# EAGLE design Faders (EAGLE 7.4.0)
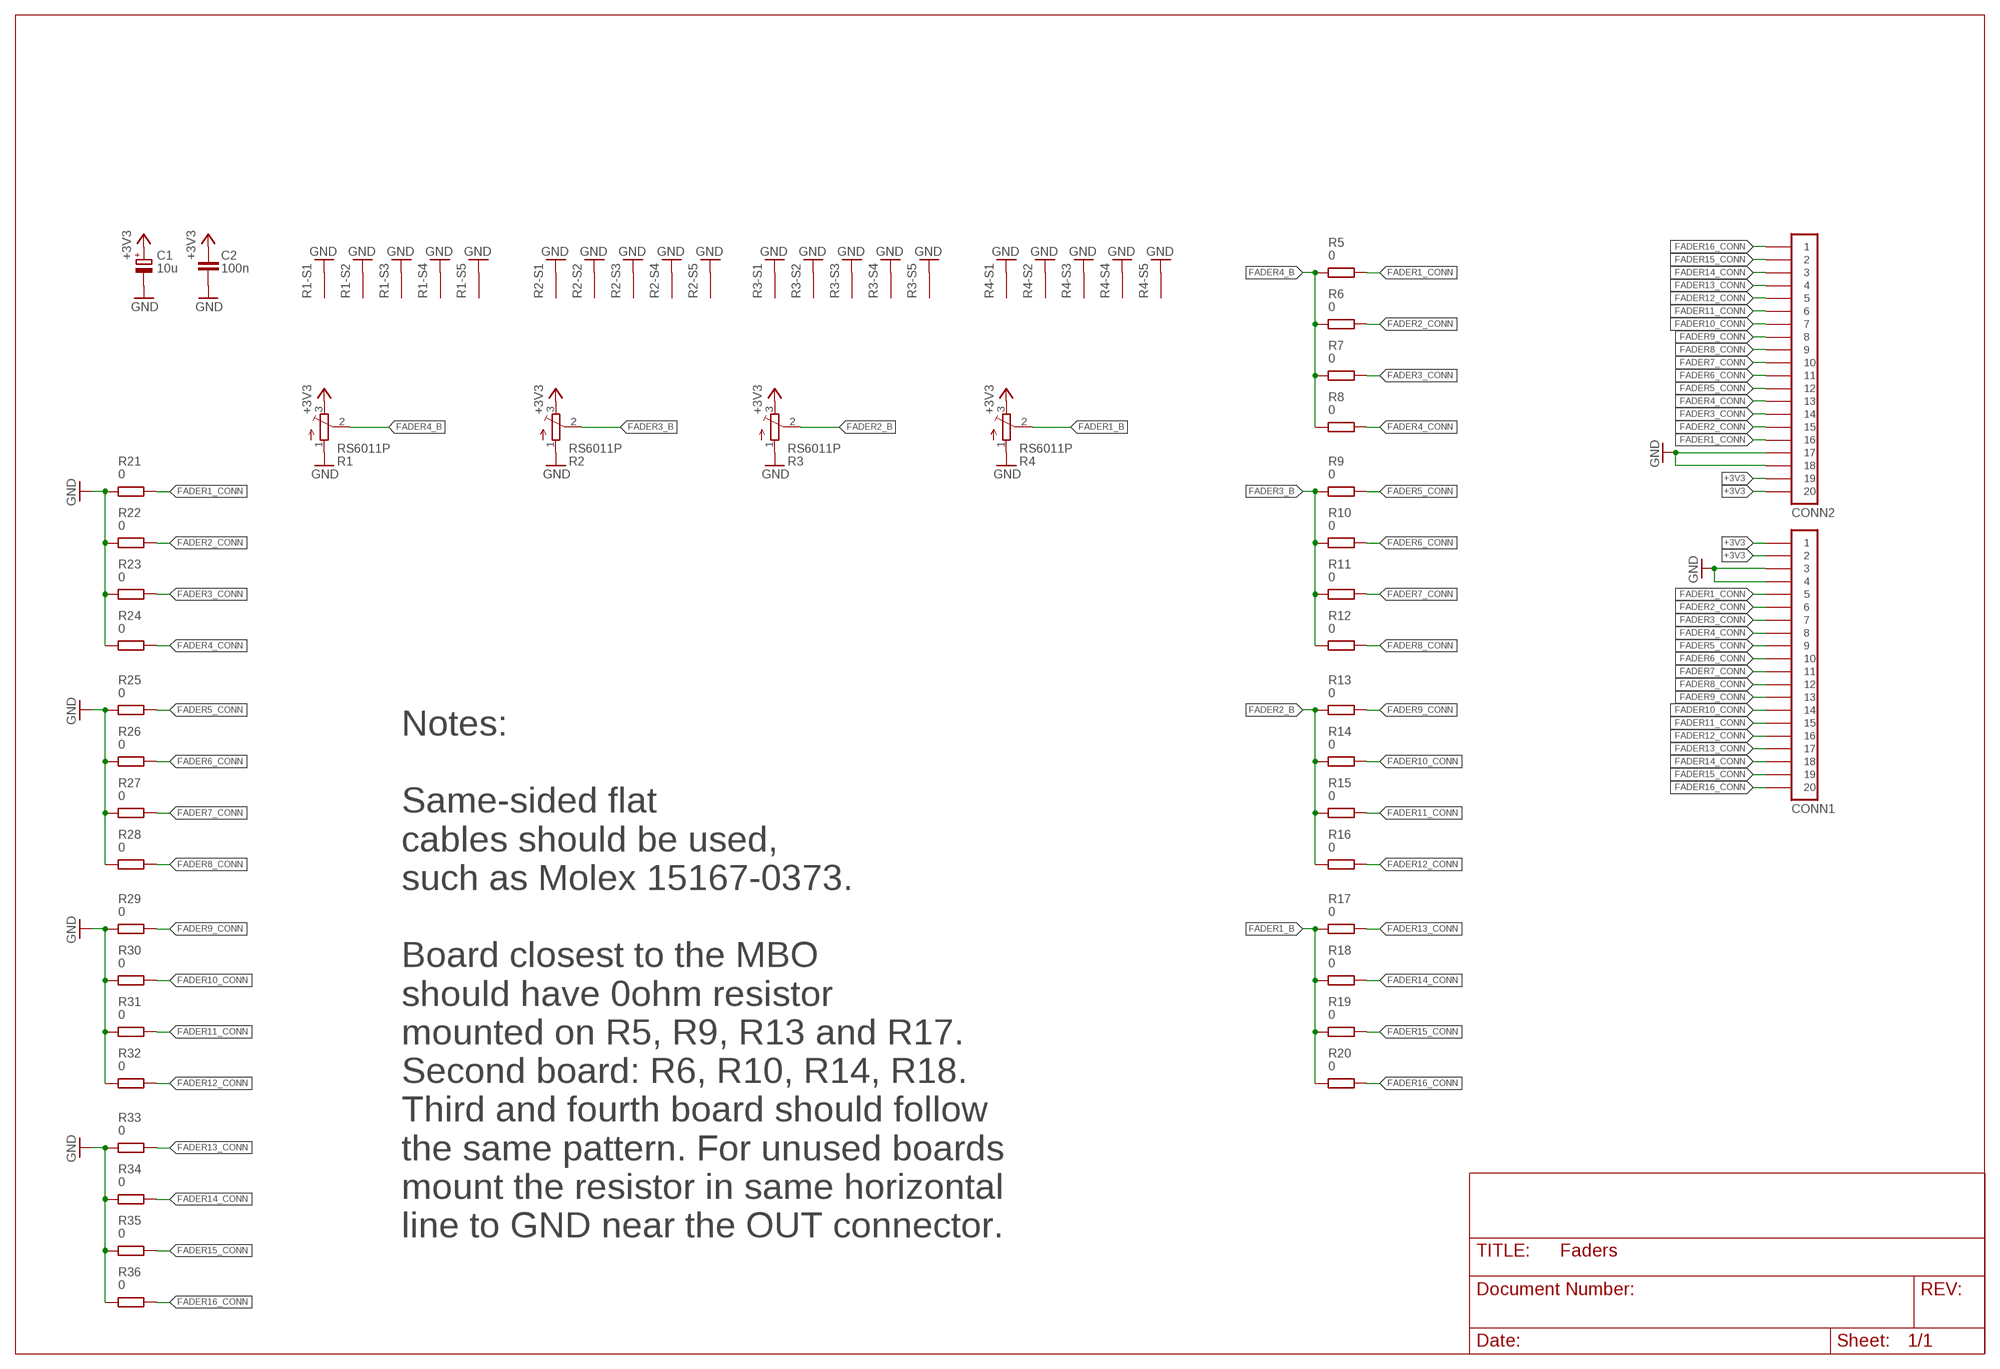
[diagram p0: schematic, sheet 1]

## Parts
C1  10u  ELECTROLYTIC_CAPACITOR-C-TH-E-0401  [C-TH-E-0401]
C2  100n  CAPACITOR-0805  [C0805]
CONN1  PINHD-1X20-SMD  [MOLEX-52271-2079]
CONN2  PINHD-1X20-SMD  [MOLEX-52271-2079]
R1  RS6011P  [RS6011*P]
R2  RS6011P  [RS6011*P]
R3  RS6011P  [RS6011*P]
R4  RS6011P  [RS6011*P]
R5  0  RESISTOR-0805  [R0805]
R6  0  RESISTOR-0805  [R0805]
R7  0  RESISTOR-0805  [R0805]
R8  0  RESISTOR-0805  [R0805]
R9  0  RESISTOR-0805  [R0805]
R10  0  RESISTOR-0805  [R0805]
R11  0  RESISTOR-0805  [R0805]
R12  0  RESISTOR-0805  [R0805]
R13  0  RESISTOR-0805  [R0805]
R14  0  RESISTOR-0805  [R0805]
R15  0  RESISTOR-0805  [R0805]
R16  0  RESISTOR-0805  [R0805]
R17  0  RESISTOR-0805  [R0805]
R18  0  RESISTOR-0805  [R0805]
R19  0  RESISTOR-0805  [R0805]
R20  0  RESISTOR-0805  [R0805]
R21  0  RESISTOR-0805  [R0805]
R22  0  RESISTOR-0805  [R0805]
R23  0  RESISTOR-0805  [R0805]
R24  0  RESISTOR-0805  [R0805]
R25  0  RESISTOR-0805  [R0805]
R26  0  RESISTOR-0805  [R0805]
R27  0  RESISTOR-0805  [R0805]
R28  0  RESISTOR-0805  [R0805]
R29  0  RESISTOR-0805  [R0805]
R30  0  RESISTOR-0805  [R0805]
R31  0  RESISTOR-0805  [R0805]
R32  0  RESISTOR-0805  [R0805]
R33  0  RESISTOR-0805  [R0805]
R34  0  RESISTOR-0805  [R0805]
R35  0  RESISTOR-0805  [R0805]
R36  0  RESISTOR-0805  [R0805]

## Nets
+3V3: C1.+ C2.1 CONN1.1 CONN1.2 CONN2.19 CONN2.20 R1.3 R2.3 R3.3 R4.3
FADER1_B: R4.2 R17.1 R18.1 R19.1 R20.1
FADER1_CONN: CONN1.5 CONN2.16 R5.2 R21.2
FADER2_B: R3.2 R13.1 R14.1 R15.1 R16.1
FADER2_CONN: CONN1.6 CONN2.15 R6.2 R22.2
FADER3_B: R2.2 R9.1 R10.1 R11.1 R12.1
FADER3_CONN: CONN1.7 CONN2.14 R7.2 R23.2
FADER4_B: R1.2 R5.1 R6.1 R7.1 R8.1
FADER4_CONN: CONN1.8 CONN2.13 R8.2 R24.2
FADER5_CONN: CONN1.9 CONN2.12 R9.2 R25.2
FADER6_CONN: CONN1.10 CONN2.11 R10.2 R26.2
FADER7_CONN: CONN1.11 CONN2.10 R11.2 R27.2
FADER8_CONN: CONN1.12 CONN2.9 R12.2 R28.2
FADER9_CONN: CONN1.13 CONN2.8 R13.2 R29.2
FADER10_CONN: CONN1.14 CONN2.7 R14.2 R30.2
FADER11_CONN: CONN1.15 CONN2.6 R15.2 R31.2
FADER12_CONN: CONN1.16 CONN2.5 R16.2 R32.2
FADER13_CONN: CONN1.17 CONN2.4 R17.2 R33.2
FADER14_CONN: CONN1.18 CONN2.3 R18.2 R34.2
FADER15_CONN: CONN1.19 CONN2.2 R19.2 R35.2
FADER16_CONN: CONN1.20 CONN2.1 R20.2 R36.2
GND: C1.- C2.2 CONN1.3 CONN1.4 CONN2.17 CONN2.18 R1.1 R1.S1(S) R1.S2(S) R1.S3(S) R1.S4(S) R1.S5(S) R2.1 R2.S1(S) R2.S2(S) R2.S3(S) R2.S4(S) R2.S5(S) R3.1 R3.S1(S) R3.S2(S) R3.S3(S) R3.S4(S) R3.S5(S) R4.1 R4.S1(S) R4.S2(S) R4.S3(S) R4.S4(S) R4.S5(S) R21.1 R22.1 R23.1 R24.1 R25.1 R26.1 R27.1 R28.1 R29.1 R30.1 R31.1 R32.1 R33.1 R34.1 R35.1 R36.1

## Notes on the sheet
- Notes:
  
  Same-sided flat
  cables should be used,
  such as Molex 15167-0373.
  
  Board closest to the MBO
  should have 0ohm resistor
  mounted on R5, R9, R13 and R17.
  Second board: R6, R10, R14, R18.
  Third and fourth board should follow
  the same pattern. For unused boards
  mount the resistor in same horizontal
  line to GND near the OUT connector.

## Library data of the parts
C1 = igor_lbr:ELECTROLYTIC_CAPACITOR: Electrolytic capacitor
C2 = igor_lbr:CAPACITOR: Capacitor
CONN1 CONN2 = igor_lbr:PINHD-1X20: Pin header, 20 pins; MANUFACTURER: Molex; MPN: 52271-2079
R1-R4 = igor_lbr:RS6011*P: Potentiometer
R5-R36 = igor_lbr:RESISTOR: Resistor

## Board
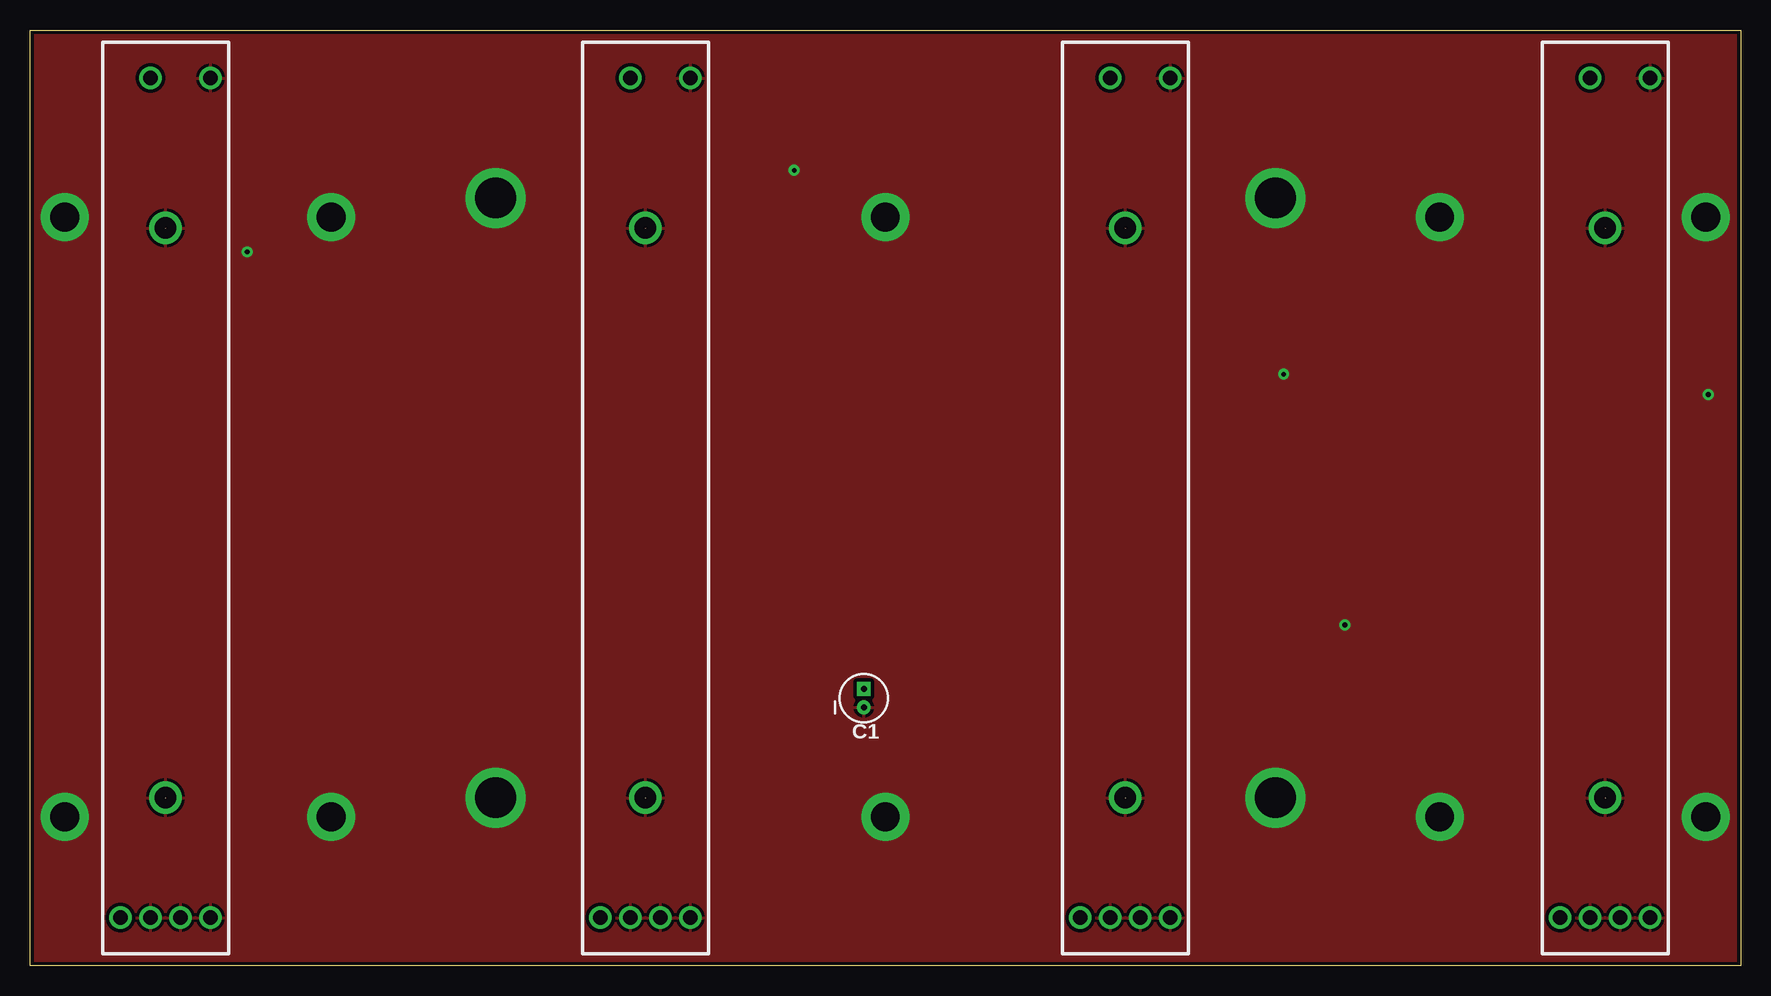
[diagram p1: board, top side]
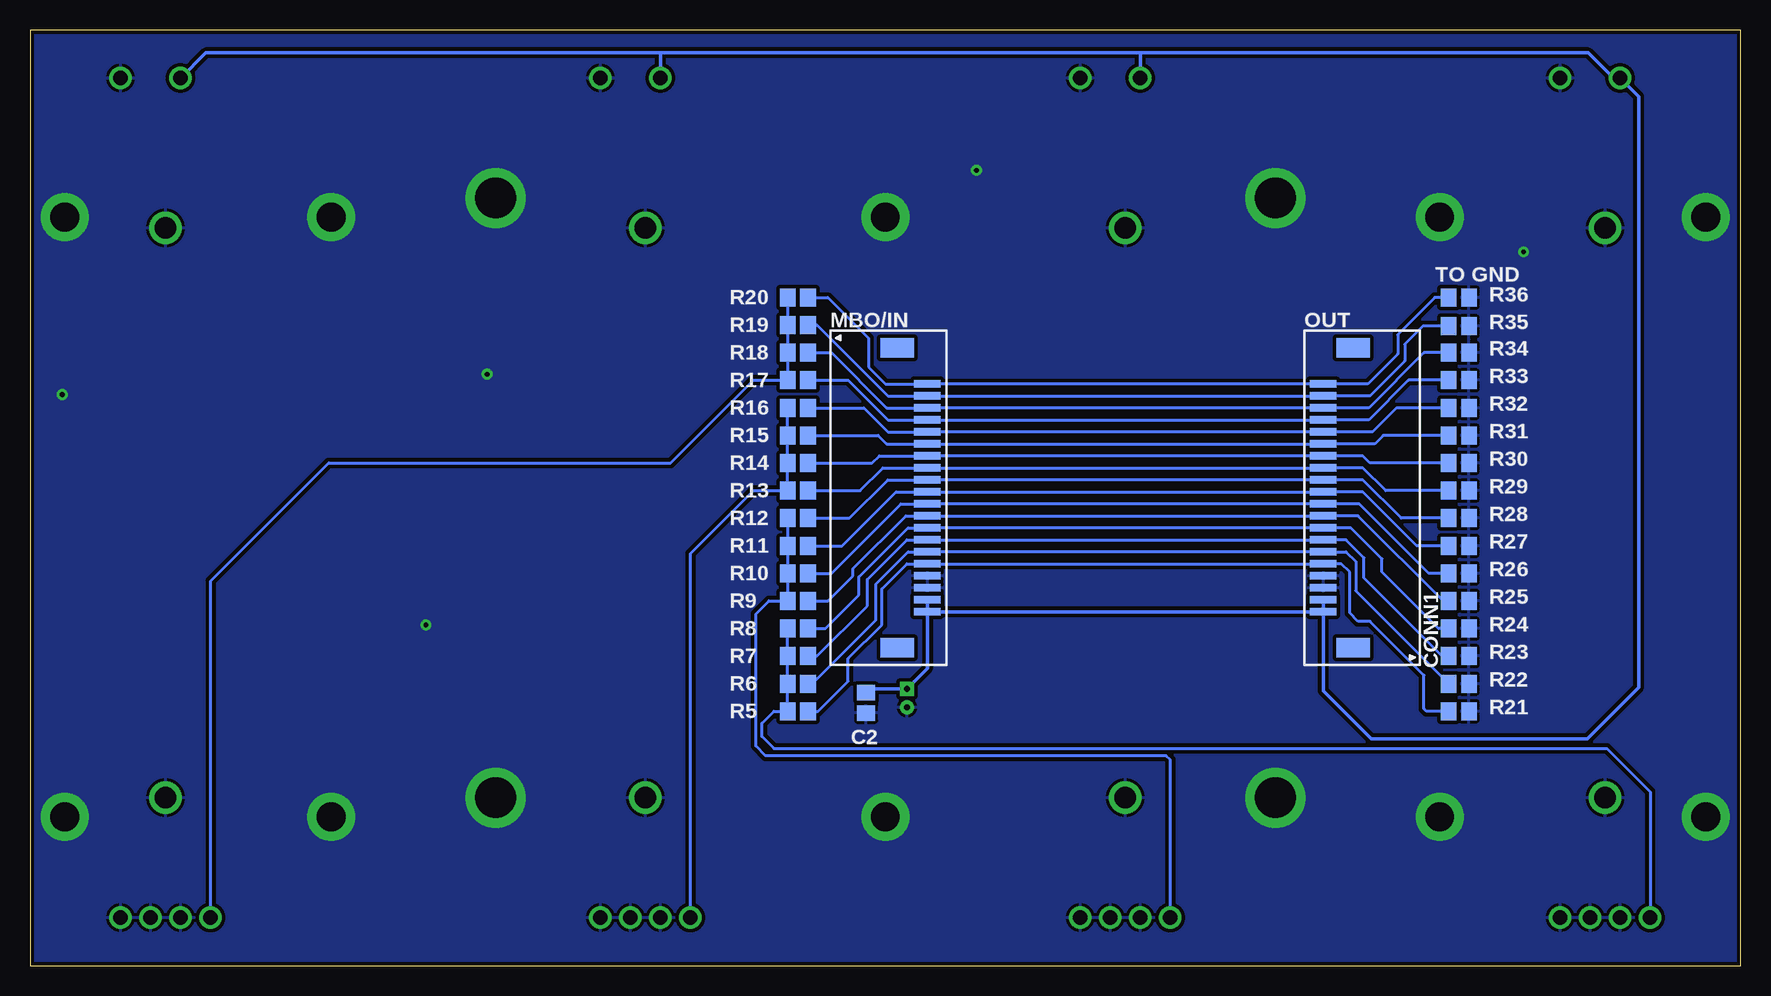
[diagram p2: board, bottom side, seen from below]

Size 142.6 x 78 mm. Coordinates in mm from the lower left corner, seen from the top.
Outline: 0,78 142.6,78 142.6,0 0,0 0,78
Copper layers (1*16): Top 0.035mm / dielectric 1.5mm / Bottom 0.035mm
Design rules "smiery *": minimum track width 10mil, minimum drill 12mil, track to track 7mil, track to pad 5mil, pad to pad 4mil, via to via 6mil, smd to smd 0mil, copper to edge 12mil, drill to drill 10mil, minimum pad ring 13mil, minimum via ring 10mil, stop-mask expansion 2mil, vias tented up to drill 25mil, thermal gap 10mil

### Footprints (pad centres in the part's own frame; a part is rotated, then mirrored left to right if it is on the bottom)
C-TH-E-0401 = drill 0.5 square: + 0.77,0 | drill 0.5: - -0.77,0
C0805 = smd 1.3 x 1.5: 1 -0.85,0; 2 0.85,0
MOLEX-52271-2079 = smd 0.6 x 2.2: 1 -9.5,3.5; 2 -8.5,3.5; 3 -7.5,3.5; 4 -6.5,3.5; 5 -5.5,3.5; 6 -4.5,3.5; 7 -3.5,3.5; 8 -2.5,3.5; 9 -1.5,3.5; 10 -0.5,3.5; 11 0.5,3.5; 12 1.5,3.5; 13 2.5,3.5; 14 3.5,3.5; 15 4.5,3.5; 16 5.5,3.5; 17 6.5,3.5; 18 7.5,3.5; 19 8.5,3.5; 20 9.5,3.5 | smd 1.65 x 2.8: S1 -12.5,1; S2 12.5,1
RS6011*P = drill 1.2: 1 -35,1.25; 2 -35,3.75; 3 35,1.25; S1 -35,-1.25; S2 -35,-3.75; S5 35,-3.75 | drill 1.8: S3 -25,0; S4 22.5,0
R0805 = smd 1.3 x 1.5: 1 -0.85,0; 2 0.85,0

### Placement (x,y rotation side)
C1  69.5,22.3 90 top
C2  72.9,21.9 270 bottom
CONN1  31.3,39 90 bottom
CONN2  71.3,39 270 bottom
R1  11.3,39 90 top
R2  51.3,39 90 top
R3  91.3,39 90 top
R4  131.3,39 90 top
R5  78.6,21.2 0 bottom
R6  78.6,23.5 0 bottom
R7  78.6,25.8 0 bottom
R8  78.6,28.1 0 bottom
R9  78.6,30.4 0 bottom
R10  78.6,32.7 0 bottom
R11  78.6,35 0 bottom
R12  78.6,37.3 0 bottom
R13  78.6,39.6 0 bottom
R14  78.6,41.9 0 bottom
R15  78.6,44.2 0 bottom
R16  78.6,46.5 0 bottom
R17  78.6,48.8 0 bottom
R18  78.6,51.1 0 bottom
R19  78.6,53.4 0 bottom
R20  78.6,55.7 0 bottom
R21  23.5,21.2 180 bottom
R22  23.5,23.5 180 bottom
R23  23.5,25.8 180 bottom
R24  23.5,28.1 180 bottom
R25  23.5,30.4 180 bottom
R26  23.5,32.7 180 bottom
R27  23.5,35 180 bottom
R28  23.5,37.3 180 bottom
R29  23.5,39.6 180 bottom
R30  23.5,41.9 180 bottom
R31  23.5,44.2 180 bottom
R32  23.5,46.5 180 bottom
R33  23.5,48.8 180 bottom
R34  23.5,51.1 180 bottom
R35  23.5,53.3 180 bottom
R36  23.5,55.7 180 bottom

### Tracks (layer width: path | path; a pad name or v marks a point on that pad's centre or on a via)
+3V3
  Bottom 0.305: CONN2.19 CONN2.20 | 50.1,76.1 12.7,76.1 10.6,74 R1.3 8.5,72.45 8.5,23.2 12.8,18.9 30.8,18.9 34.8,22.9 CONN1.1 | 50.1,76.1 90.1,76.1 | 90.1,76.1 127.95,76.1 R4.3 | R2.3 50.05,76.05 50.1,76.1 | R3.3 90.05,76.05 90.1,76.1 | CONN1.2 CONN1.1 | CONN1.1 CONN2.20 | CONN2.20 67.8,24.77 C1.+ 72.58,23.07 C2.1
FADER1_B
  Bottom 0.254: R4.2 127.55,32.05 117.7,41.9 89.2,41.9 82.3,48.8 R17.1 R18.1 R19.1 R20.1
FADER1_CONN
  Bottom 0.254: R5.2 76.9,21.2 74.4,23.7 74.4,25.6 71.6,28.4 71.6,31.4 69.5,33.5 CONN2.16 CONN1.5 33.3,33.5 32.6,32.8 32.6,29.4 31.9,28.7 30.9,28.7 26.4,24.2 26.4,21.4 26.2,21.2 R21.2
FADER2_B
  Bottom 0.254: R16.1 R15.1 R14.1 R13.1 82.3,39.6 87.55,34.35 R3.2
FADER2_CONN
  Bottom 0.254: R6.2 77.4,23.5 72.1,28.8 72.1,31.8 69.4,34.5 CONN2.15 CONN1.6 32.9,34.5 32.1,33.7 32.1,31.25 R22.2
FADER3_B
  Bottom 0.254: R12.1 R11.1 R10.1 R9.1 81,30.4 82.1,29.3 82.1,18.3 81.3,17.5 47.9,17.5 47.55,17.15 R2.2
FADER3_CONN
  Bottom 0.254: R7.2 77,25.8 72.8,30 72.8,32.2 69.5,35.5 CONN2.14 CONN1.7 32.9,35.5 31.4,34 31.4,32.3 24.9,25.8 R23.2
FADER4_B
  Bottom 0.254: R8.1 R7.1 R6.1 R5.1 80.6,21.2 81.6,20.2 81.6,19.1 80.6,18.1 11.15,18.1 7.55,14.5 R1.2
FADER4_CONN
  Bottom 0.254: R8.2 76.3,28.1 73.5,30.9 73.5,32.4 69.4,36.5 CONN2.13 CONN1.8 32.5,36.5 29.9,33.9 29.9,32.8 25.2,28.1 R24.2
FADER5_CONN
  Bottom 0.254: R9.2 76.1,30.4 74,32.5 74,33.1 69.6,37.5 CONN2.12 CONN1.9 31.9,37.5 24.8,30.4 R25.2
FADER6_CONN
  Bottom 0.254: R10.2 75.8,32.7 70,38.5 CONN2.11 CONN1.10 31.8,38.5 26,32.7 R26.2
FADER7_CONN
  Bottom 0.254: R11.2 74.9,35 70.4,39.5 CONN2.10 CONN1.11 31.5,39.5 27,35 R27.2
FADER8_CONN
  Bottom 0.254: R12.2 74.3,37.3 71.1,40.5 CONN2.9 CONN1.12 31.5,40.5 28.3,37.3 R28.2
FADER9_CONN
  Bottom 0.254: R13.2 73.4,39.6 71.5,41.5 CONN2.8 CONN1.13 31.5,41.5 29.6,39.6 R29.2
FADER10_CONN
  Bottom 0.254: R14.2 72.4,41.9 71.8,42.5 CONN2.7 CONN1.14 31.5,42.5 30.9,41.9 R30.2
FADER11_CONN
  Bottom 0.254: R15.2 71.9,44.2 71.2,43.5 CONN2.6 CONN1.15 30.5,43.5 29.8,44.2 R31.2
FADER12_CONN
  Bottom 0.254: R16.2 73.1,46.5 71.1,44.5 CONN2.5 CONN1.16 30.7,44.5 28.7,46.5 R32.2
FADER13_CONN
  Bottom 0.254: R17.2 74.4,48.8 71.1,45.5 CONN2.4 CONN1.17 31,45.5 27.7,48.8 R33.2
FADER14_CONN
  Bottom 0.254: R18.2 75.8,51.1 71.2,46.5 CONN2.3 CONN1.18 31,46.5 26.4,51.1 R34.2
FADER15_CONN
  Bottom 0.254: R19.2 77,53.4 71.1,47.5 CONN2.2 CONN1.19 30.9,47.5 28,50.4 28,51.8 26.5,53.3 R35.2
FADER16_CONN
  Bottom 0.254: R20.2 76.1,55.7 72.7,52.3 72.7,49.9 71.3,48.5 CONN2.1 CONN1.20 31.1,48.5 28.6,51 28.6,52.6 25.5,55.7 R36.2
GND  (via drill 0.4 pad 0.6, 2.4 pad 4, 3.4 pad 5)
  other vias: 103.8,64 103.8,14 38.8,14 38.8,64 25.1,62.4 25.1,12.4 117.5,12.4 117.5,62.4 71.3,62.4 71.3,12.4 2.9,62.4 2.9,12.4 139.7,12.4 139.7,62.4 18.1,59.5 63.7,66.3 104.5,49.3 109.6,28.4 139.9,47.6
  pour Bottom (isolate 0.305): 0,78 142.6,78 142.6,0 0,0
  pour Top (isolate 0.305): 0,78 142.6,78 142.6,0 0,0

### Text on the board
bNames: TO GND | OUT | MBO/IN